# EAGLE schematic 51-zduino (EAGLE 5.07)
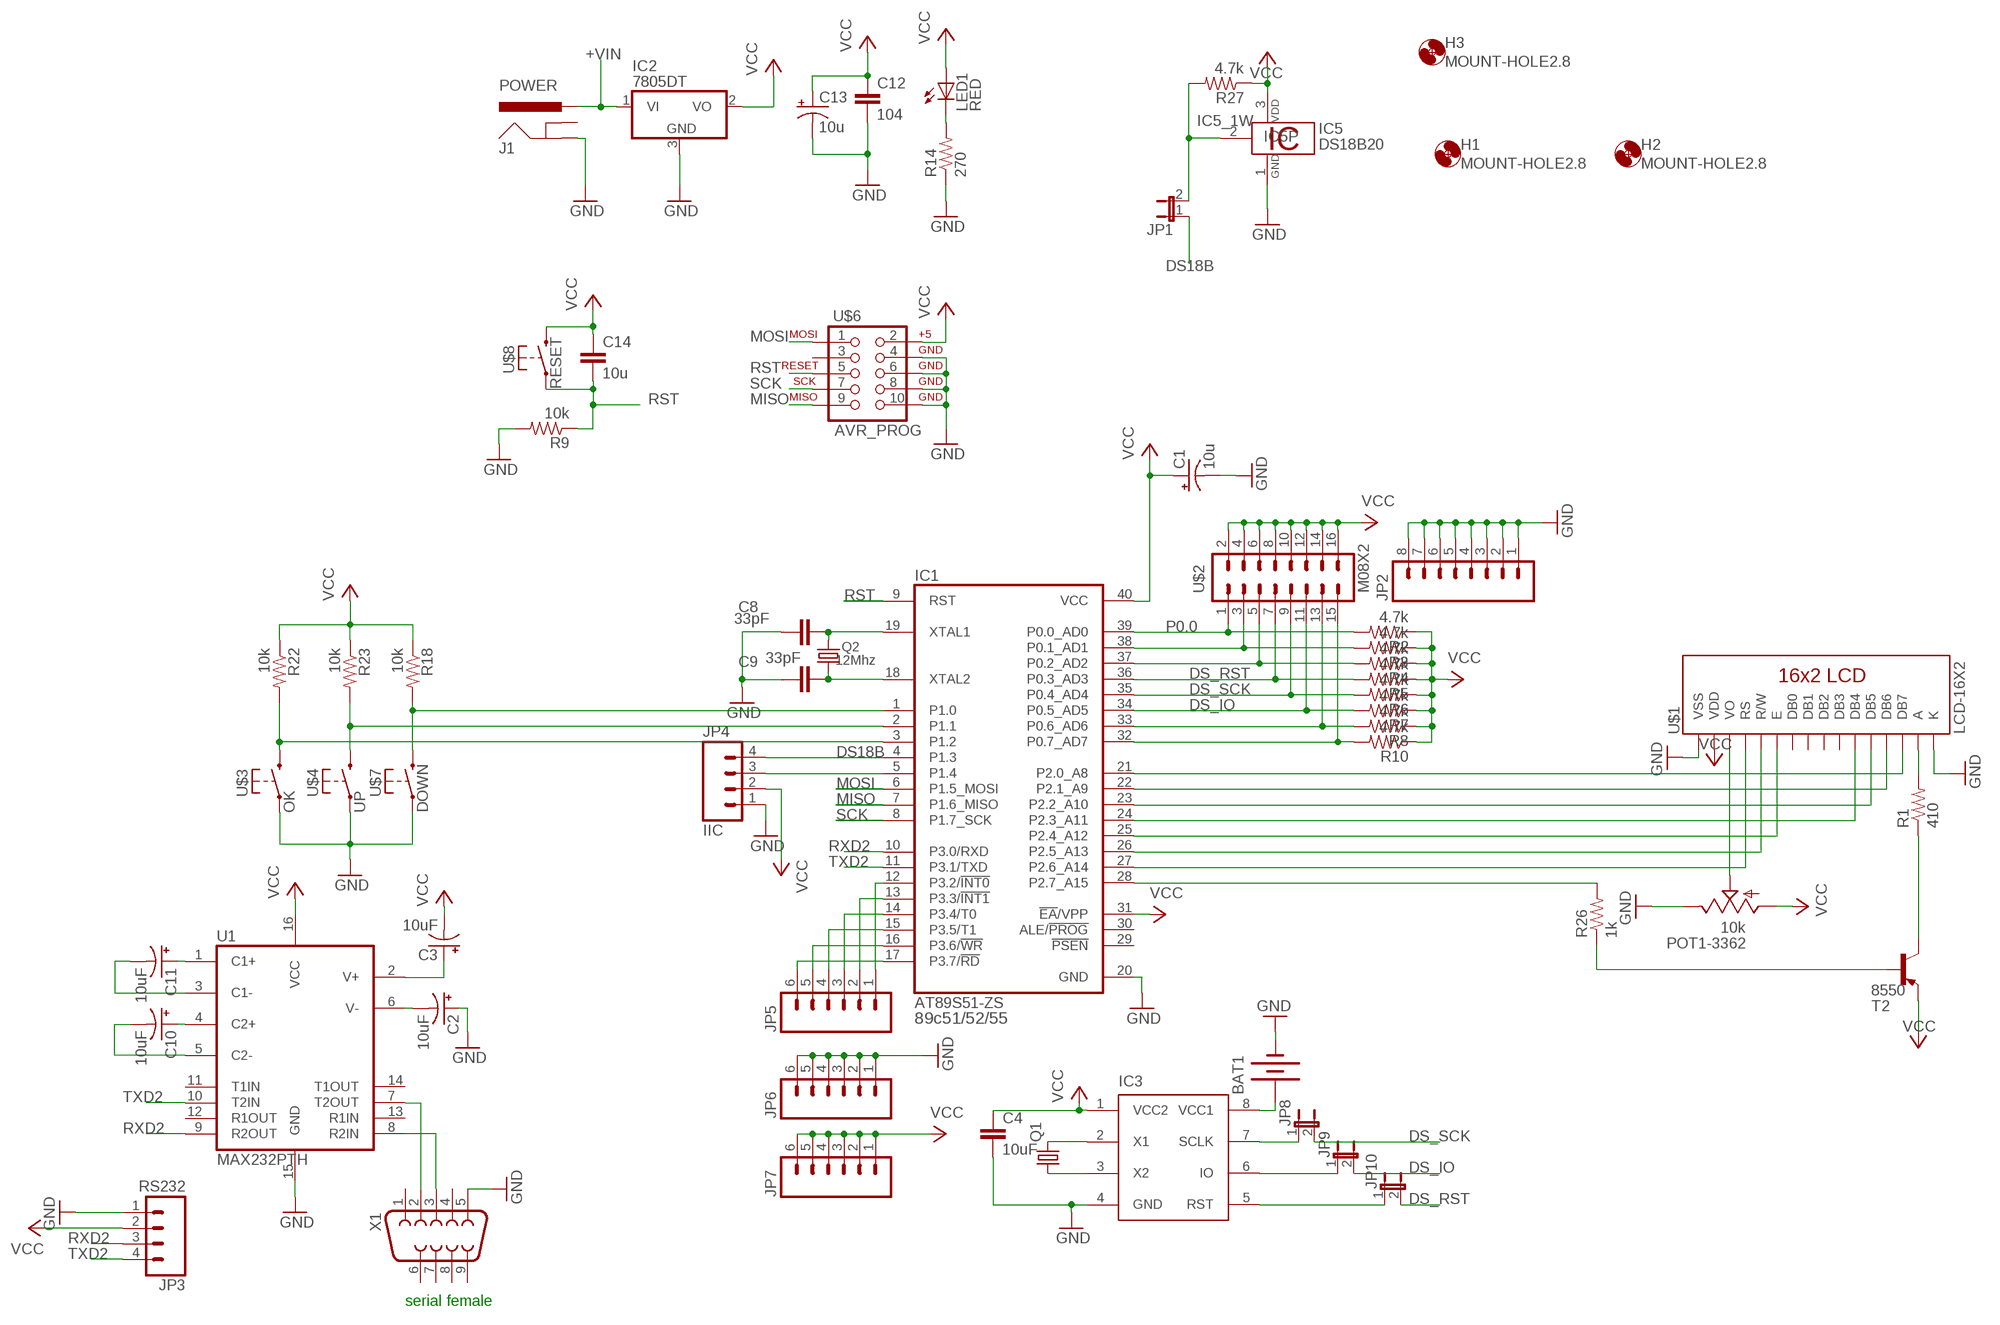
[diagram p0: schematic, sheet 1]

## Parts
BAT1  BATTERY20PTH  [BATTCOM_20MM_PTH]
C1  10u  CAP_POL1206  [EIA3216]
C2  10uF  CAP_POL3528  [EIA3528]
C3  10uF  CAP_POL3528  [EIA3528]
C4  10uF  CAPC1206K  [C1206K]
C8  33pF  CAPPTH1  [CAP-PTH-5MM]
C9  33pF  CAPPTH1  [CAP-PTH-5MM]
C10  10uF  CAP_POL3528  [EIA3528]
C11  10uF  CAP_POL3528  [EIA3528]
C12  104  CAP0805  [0805]
C13  10u  CAP_POL1206  [EIA3216]
C14  10u  CAPSMD  [GRM43D]
H1  MOUNT-HOLE2.8  [2,8]
H2  MOUNT-HOLE2.8  [2,8]
H3  MOUNT-HOLE2.8  [2,8]
IC1  AT89S51-ZS  AT89S51-ZS-1280  [240-1280-00-0602J]
IC2  7805DT  [TO252]
IC3  DS1302  [PDIP8]
IC5  DS18B20  [TO92-]
J1  POWER  POWER_JACKPTH_BIG  [POWER_JACK_2.1X5.5_BIG_PTH]
JP1  JUMPER-2PTH_LOCK  [1X02_LOCK]
JP2  M08LOCK  [1X08_LOCK]
JP3  RS232  M04LOCK_LONGPADS  [1X04_LOCK_LONGPADS]
JP4  IIC  M04LOCK_LONGPADS  [1X04_LOCK_LONGPADS]
JP5  M06SIP  [1X06]
JP6  M06SIP  [1X06]
JP7  M06SIP  [1X06]
JP8  JUMPER-2PTH_LOCK  [1X02_LOCK]
JP9  JUMPER-2PTH_LOCK  [1X02_LOCK]
JP10  JUMPER-2PTH_LOCK  [1X02_LOCK]
LED1  RED  LED3MM  [LED3MM]
POT1-3362  10k  POTB25P-3362P  [B25P]
Q1  CRYSTALTC38H  [TC38H]
Q2  12Mhz  CRYSTALHC49UV-SOCK  [HC49U-V-SOCK]
R1  410  RESISTOR0805  [0805]
R2  4.7k  RESISTOR0805  [0805]
R3  4.7k  RESISTOR0805  [0805]
R4  4.7k  RESISTOR0805  [0805]
R5  4.7k  RESISTOR0805  [0805]
R6  4.7k  RESISTOR0805  [0805]
R7  4.7k  RESISTOR0805  [0805]
R8  4.7k  RESISTOR0805  [0805]
R9  10k  RESISTOR0805  [0805]
R10  4.7k  RESISTOR0805  [0805]
R14  270  RESISTOR0805  [0805]
R18  10k  RESISTOR0805  [0805]
R22  10k  RESISTOR0805  [0805]
R23  10k  RESISTOR0805  [0805]
R26  1k  RESISTOR0805  [0805]
R27  4.7k  RESISTOR0805  [0805]
T2  8550  -PNP-SOT23-BEC  [SOT23-BEC]
U1  MAX232PTH  [DIL16]
U$1  LCD-16X2  [LCD-16X2]
U$2  M08X2  [2X8]
U$3  OK  TACT_SWITCH-2-PTH  [ALPS-SKHV]
U$4  UP  TACT_SWITCH-2-PTH  [ALPS-SKHV]
U$6  AVR_PROG  AVR_SPI_PROG2LOCK  [2X5-SHROUDED_LOCK]
U$7  DOWN  TACT_SWITCH-2-PTH  [ALPS-SKHV]
U$8  RESET  TACT_SWITCH-2-PTH  [ALPS-SKHV]
X1  DB9  [DB9]

## Nets
1W: IC5.2 JP1.2 R27.2
+VIN: IC2.1(VI) J1.PWR
DS18B: IC1.4(P1.3) JP1.1 JP4.4
DS_IO: IC1.34(P0.5_AD5) JP9.2 R7.2 U$2.11
DS_RST: IC1.36(P0.3_AD3) JP10.2 R5.2 U$2.7
DS_SCK: IC1.35(P0.4_AD4) JP8.2 R6.2 U$2.9
GND: BAT1.2(-) C1.C(-) C2.A(+) C4.2 C8.2 C9.2 C12.2 C13.C(-) IC1.20(GND) IC2.3(GND) IC3.4(GND) IC5.1 J1.GND JP2.1 JP2.2 JP2.3 JP2.4 JP2.5 JP2.6 JP2.7 JP2.8 JP3.1 JP4.1 JP6.1 JP6.2 JP6.3 JP6.4 JP6.5 JP6.6 POT1-3362.E R9.2 R14.1 U1.15(GND) U$1.1(VSS) U$1.16(K) U$3.2 U$4.2 U$6.4 U$6.6 U$6.8 U$6.10 U$7.2 X1.5
KD: IC1.1(P1.0) R18.2 U$7.3
KO: IC1.3(P1.2) R22.2 U$3.3
KU: IC1.2(P1.1) R23.2 U$4.3
MISO: IC1.7(P1.6_MISO) U$6.9
MOSI: IC1.6(P1.5_MOSI) U$6.1
N$1: IC1.27(P2.6_A14) U$1.4(RS)
N$2: IC1.26(P2.5_A13) U$1.5(R/W)
N$3: IC1.25(P2.4_A12) U$1.6(E)
N$4: IC1.24(P2.3_A11) U$1.11(DB4)
N$5: IC1.23(P2.2_A10) U$1.12(DB5)
N$6: C2.C(-) U1.6(V-)
N$7: IC1.21(P2.0_A8) U$1.14(DB7)
N$8: C10.C(-) U1.5(C2-)
N$9: C10.A(+) U1.4(C2+)
N$10: C11.A(+) U1.1(C1+)
N$11: C3.A(+) U1.2(V+)
N$12: C11.C(-) U1.3(C1-)
N$13: U1.7(T2OUT) X1.2
N$14: C9.1 IC1.18(XTAL2) Q2.1
N$15: POT1-3362.S U$1.3(VO)
N$16: R1.2 U$1.15(A)
N$17: LED1.K(C) R14.2
N$18: IC1.28(P2.7_A15) R26.2
N$19: R1.1 T2.C
N$20: IC1.38(P0.1_AD1) R3.2 U$2.3
N$21: IC1.37(P0.2_AD2) R4.2 U$2.5
N$23: IC1.22(P2.1_A9) U$1.13(DB6)
N$24: U1.8(R2IN) X1.3
N$27: IC1.33(P0.6_AD6) R8.2 U$2.13
N$28: IC1.32(P0.7_AD7) R10.2 U$2.15
N$29: IC1.5(P1.4) JP4.3
N$30: IC1.12(P3.2/!INT0) JP5.1
N$31: IC1.13(P3.3/!INT1) JP5.2
N$32: IC1.14(P3.4/T0) JP5.3
N$33: IC1.15(P3.5/T1) JP5.4
N$34: C8.1 IC1.19(XTAL1) Q2.2
N$35: IC1.16(P3.6/!WR) JP5.5
N$36: IC1.17(P3.7/!RD) JP5.6
N$37: IC3.2(X1) Q1.2
N$38: IC3.3(X2) Q1.1
N$39: BAT1.1(+) IC3.8(VCC1)
N$40: IC3.7(SCLK) JP8.1
N$41: IC3.6(IO) JP9.1
N$42: IC3.5(RST) JP10.1
N$55: R26.1 T2.B
P0.0: IC1.39(P0.0_AD0) R2.2 U$2.1
RST: C14.C IC1.9(RST) R9.1 U$6.5 U$8.2
RXD2: IC1.10(P3.0/RXD) JP3.3 U1.9(R2OUT)
SCK: IC1.8(P1.7_SCK) U$6.7
TXD2: IC1.11(P3.1/TXD) JP3.4 U1.10(T2IN)
VCC: C1.A(+) C3.C(-) C4.1 C12.1 C13.A(+) C14.A IC1.31(!EA!/VPP) IC1.40(VCC) IC2.2(VO) IC3.1(VCC2) IC5.3 JP3.2 JP4.2 JP7.1 JP7.2 JP7.3 JP7.4 JP7.5 JP7.6 LED1.A POT1-3362.A R2.1 R3.1 R4.1 R5.1 R6.1 R7.1 R8.1 R10.1 R18.1 R22.1 R23.1 R27.1 T2.E U1.16(VCC) U$1.2(VDD) U$2.2 U$2.4 U$2.6 U$2.8 U$2.10 U$2.12 U$2.14 U$2.16 U$6.2 U$8.3
Unconnected: IC1.29(!PSEN) IC1.30(ALE/!PROG) J1.GNDBREAK U1.11(T1IN) U1.12(R1OUT) U1.13(R1IN) U1.14(T1OUT) U$1.7(DB0) U$1.8(DB1) U$1.9(DB2) U$1.10(DB3) U$6.3 X1.1 X1.4 X1.6 X1.7 X1.8 X1.9

## Notes on the sheet
- 89c51/52/55
- serial female

## Library data of the parts
BAT1 = SparkFun:BATTERY: Battery Holders Various common sizes : AA, AAA, 20mm coin cell and 12mm coin cell.
C1 C13 = SparkFun:CAP_POL: Capacitor Polarized
C2 C3 C10 C11 = digital-toy:CAP_POL: Capacitor Polarized
C4 C8 C9 = digital-toy:CAP: Capacitor Standard 0603 ceramic capacitor, and 0.1" leaded capacitor.
C12 C14 = SparkFun:CAP: Capacitor Standard 0603 ceramic capacitor, and 0.1" leaded capacitor.
H1-H3 = holes:MOUNT-HOLE: MOUNTING HOLE with drill center marker
IC1 = digital-toy:AT89S51-*: 8-bit Microcontroller with 4K BytesIn-System Programmable Flash Source: http://www.atmel.com/dyn/resources/prod_documents/doc2487.pdf
IC2 = linear:78*: Positive VOLTAGE REGULATOR Source: http://cache.national.com/ds/LM/LM78L05.pdf http://www.fairchildsemi.com/ds/LM/LM7805.pdf
IC3 = ltc1440_lt1529_ds1302:DS1302: DS1302 Realtime Clock The DS1302 trickle-charge timekeeping chip contains a real-time clock/calendar and 31 bytes of static RAM. It communicates with a microprocessor via a simple serial interface. The real-time clock/calendar provides seconds, minutes, hours, day, date, month, and year information. The end of the month date is automatically adjusted for months with fewer than 31 days, including corrections for leap year. The clock operates in either the 24-hour or 12-hour format with an AM/PM indicator. Interfacing the DS1302 with a microprocessor is simplified by using synchronous serial communication. Only three wires are required to communicate with the clock/RAM: CE, I/O (data line), and SCLK (serial clock). Data can be transferred to and from the clock/RAM 1 byte at a time or in a burst of up to 31 bytes. The DS1302 is designed to operate on very low power and retain data and clock information on less than 1µW. The DS1302 is the successor to the DS1202. In addition to the basic timekeeping functions of the DS1202, the DS1302 has the additional features of dual power pins for primary and backup power supplies, programmable trickle charger for VCC1, and seven additional bytes of scratchpad memory.
IC5 = digital-toy:DS18B20: Programmable Resolution Digital Thermometer This chip provides a onewire thermosensor with approx. 0.5°C accuracy. A programmable over/undertemperure alarm is available. The precision can be set from 9..12 bits. Notes: Vdd must be applied for accurate measurements at low temperatures, as the parasite power circuit otherwise heats the sensor. If parasite power is used, Vdd has to be connected to GND. The DS1822 is a low-cost thermometer chip, the DS18S20 is similar to the DS18B20, but with 9 Bit precision only. Author: Jan Kandziora <jjj@gmx.de>
J1 = digital-toy:POWER_JACK: Power Jack This is the standard 5.5mm barrel jack for power. The PTH is the most common, proven, reliable, footprint. All others are experimental. The Slot footprint only works if the mill layer is transmitted to the PCB fab house so be warned. Spark Fun Electronics SKU : PRT-00119. Mating wall wart : TOL-00298 (and others)
JP1 JP8-JP10 = SparkFun:JUMPER-2: Jumper Basic 0.1" spaced jumper. Use with breakaway headers.
JP2 = SparkFun:M08: Header 8 Standard 8-pin 0.1" header. Use with straight break away headers (SKU : PRT-00116), right angle break away headers (PRT-00553), swiss pins (PRT-00743), machine pins (PRT-00117), and female headers (PRT-00115).
JP3 JP4 = SparkFun:M04: Header 4 Standard 4-pin 0.1" header. Use with straight break away headers (SKU : PRT-00116), right angle break away headers (PRT-00553), swiss pins (PRT-00743), machine pins (PRT-00117), and female headers (PRT-00115). Molex polarized connector foot print use with SKU : PRT-08231 with associated crimp pins and housings.
JP5-JP7 = SparkFun:M06: Header 6 Standard 6-pin 0.1" header. Use with straight break away headers (SKU : PRT-00116), right angle break away headers (PRT-00553), swiss pins (PRT-00743), machine pins (PRT-00117), and female headers (PRT-00115). Molex polarized connector foot print use with SKU : PRT-08094 with associated crimp pins and housings. NOTES ON THE VARIANTS LOCK and LOCK_LONGPADS... This footprint was designed to help hold the alignment of a through-hole component (i.e. 6-pin header) while soldering it into place. You may notice that each hole has been shifted either up or down by 0.005 of an inch from it's more standard position (which is a perfectly straight line). This slight alteration caused the pins (the squares in the middle) to touch the edges of the holes. Because they are alternating, it causes a "brace" to hold the component in place. 0.005 has proven to be the perfect amount of "off-center" position when using our standard breakaway headers. Although looks a little odd when you look at the bare footprint, once you have a header in there, the alteration is very hard to notice. Also, if you push a header all the way into place, it is covered up entirely on the bottom side. This idea of altering the position of holes to aid alignment will be further integrated into the Sparkfun Library for other footprints. It can help hold any component with 3 or more connection pins.
LED1 = digital-toy:LED: LEDs Standard schematic elements and footprints for 5mm, 3mm, 1206, and 0603 sized LEDs. 5mm - Spark Fun Electronics SKU : COM-00529 (and others) copy led.lbr 0805 led here, by hyl digital-toy. 2010.6.29
POT1-3362 = digital-toy:POT: POT digital toy POT, 3296 multi turn, blue-white ... hyl 8/07/2001
Q1 = SparkFun:CRYSTAL: Crystals Various standard crystals. Proven footprints. Spark Fun Electronics SKU : COM-00534
Q2 = digital-toy:CRYSTAL: Crystals Various standard crystals. Proven footprints. Spark Fun Electronics SKU : COM-00534
R1-R10 R14 R18 R22 R23 R26 R27 = digital-toy:RESISTOR: Resistor Basic schematic elements and footprints for 0603, 1206, and PTH 1/10th watt (small) resistors. digital-toy copy vertical mount of axial-0.3 from rcl.lbr : the 0207/xx
T2 = digital-toy:*-PNP-: PNP Transistror
U1 = SparkFun:MAX232: RS232 Transceiver Very common IC. This is generically called 'MAX232', but works with the 3V equivalent MAX3232 generic ICs. Field tested and mother approved. Spark Fun Electronics SKU : COM-00316 (DIP) and COM-00589 (SMD)
U$1 = digital-toy:LCD-16X2
U$2 = SparkFun:M08X2
U$3 U$4 U$7 U$8 = digital-toy:TACT_SWITCH-2
U$6 = SparkFun:AVR_SPI_PROG2: AVR ICSP Header This is the standard AVR In Circuit Serial Programming header. Minimal, but includes pin one indicator. Works with standard Olimex programmers. Also look for the 6-pin reduced version. Spark Fun Electronics SKU: PRT-00778
X1 = SparkFun:DB9: DB9 Connector Standard DB9 (D-Sub 9) serial connector. Can be used for CAN bus as well as RS485 and RS232. Footprint production proven. Spark Fun Electronics SKU : PRT-00429